# Altium schematic sheet Latching - AMS.SchDoc
size A3
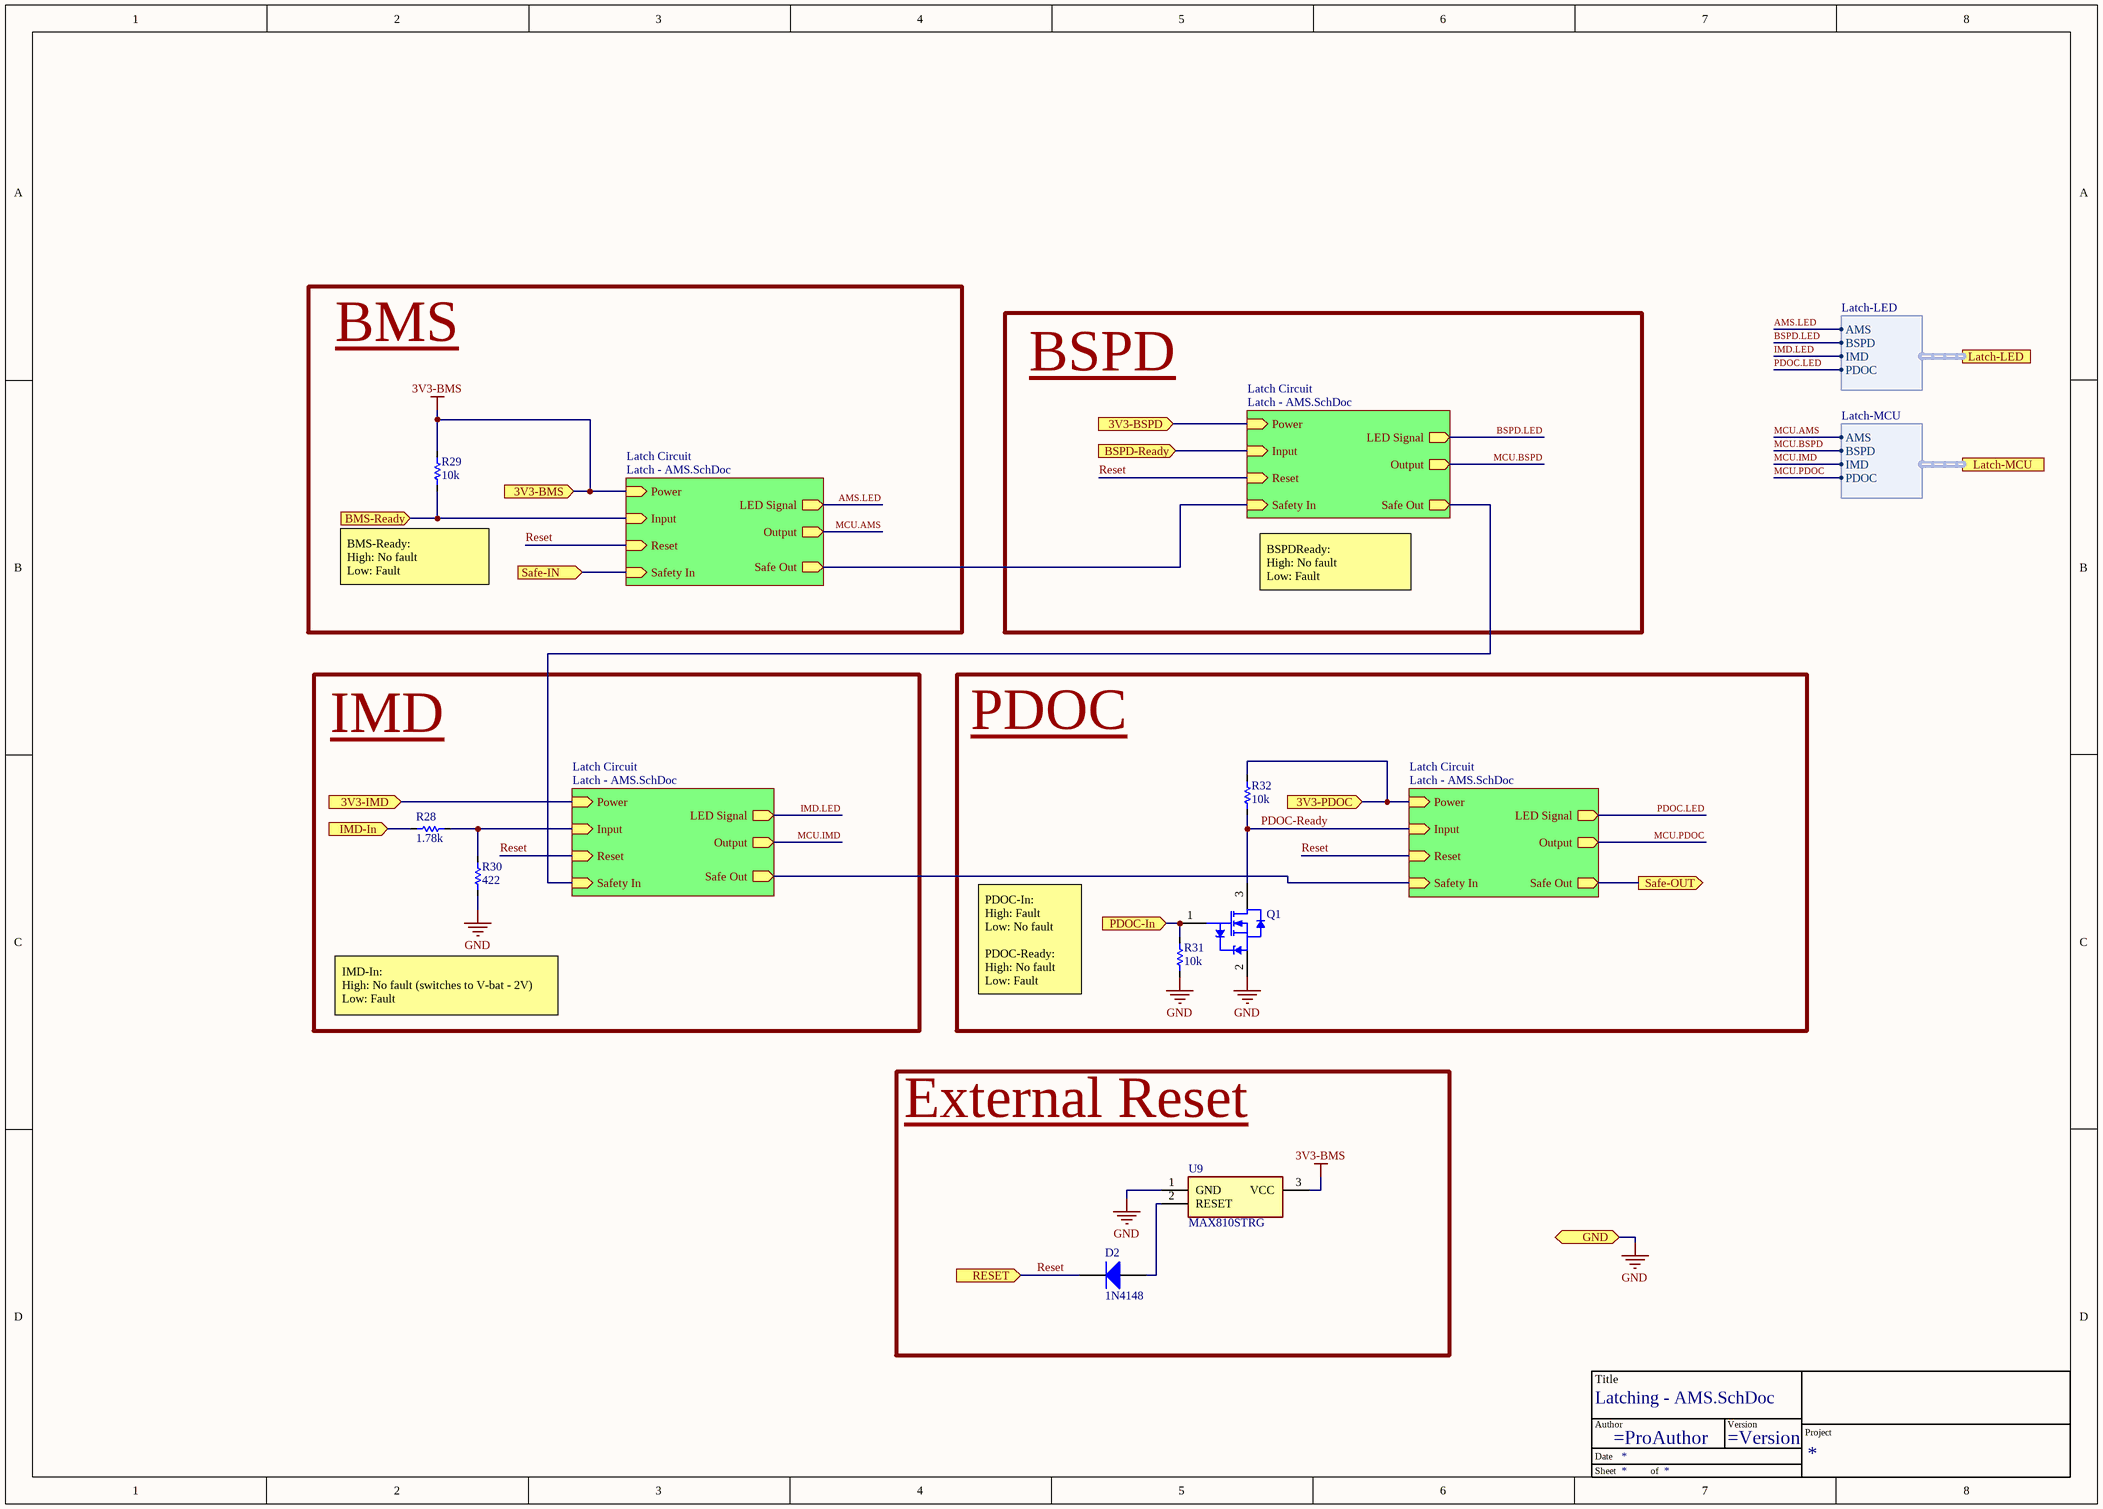
[diagram p0: Latching - AMS.SchDoc]

## Parts
*  TitleBlock  (value not drawn)  (graphical)
D2  1N4148  [425]
Q1  BSS138BK,215  [NXP-SOT23_N]  (value not drawn)
R28  value 1.78k  [R-0603]  (hidden comment: RC0603FR-071K78L)
R29  value 10k  [R-0603]  (hidden comment: RC0603FR-1310KL)
R30  value 422  [R-0603]  (hidden comment: CR0603-FX-4220ELF)
R31  value 10k  [R-0603]  (hidden comment: RC0603FR-1310KL)
R32  value 10k  [R-0603]  (hidden comment: RC0603FR-1310KL)
U9  MAX810STRG  [SOT96P237X111-3N]

## Blocks framed on the sheet
BMS: R29
IMD: R28 R30
PDOC: Q1 R31 R32
External Reset: D2 U9

## Sub-sheets
Latch Circuit = Latch - AMS.SchDoc: Input (in), Safety In (in), Safe Out (out), LED Signal (out), Power (in), Output (out), Reset (in)
Latch Circuit = Latch - AMS.SchDoc: Input (in), Safety In (in), Safe Out (out), LED Signal (out), Power (in), Output (out), Reset (in)
Latch Circuit = Latch - AMS.SchDoc: Input (in), Safety In (in), Safe Out (out), LED Signal (out), Power (in), Output (out), Reset (in)
Latch Circuit = Latch - AMS.SchDoc: Input (in), Safety In (in), Safe Out (out), LED Signal (out), Power (in), Output (out), Reset (in)

## Ports
3V3-BMS (in), 3V3-BSPD (in), 3V3-IMD (in), 3V3-PDOC (in), BMS-Ready (in), BSPD-Ready (in), GND (bidir), IMD-In (in), Latch-LED (harness Latch-LED), Latch-MCU (harness Latch-MCU), PDOC-In (in), RESET (in), Safe-IN (in), Safe-OUT (out)

## Harnesses
Latch-LED: AMS, BSPD, IMD, PDOC
Latch-MCU: AMS, BSPD, IMD, PDOC

## Nets
3V3-BMS: R29.2 U9.3(VCC) ; port 3V3-BMS, sheet Latch Circuit/Power
GND: Q1.2(S) R30.1 R31.1 U9.1(GND) ; port GND
3V3-BSPD: port 3V3-BSPD, sheet Latch Circuit/Power
3V3-IMD: port 3V3-IMD, sheet Latch Circuit/Power
3V3-PDOC: R32.2 ; port 3V3-PDOC, sheet Latch Circuit/Power
AMS.LED: sheet Latch Circuit/LED Signal, port Latch-LED.AMS
BMS-Ready: R29.1 ; port BMS-Ready, sheet Latch Circuit/Input
BSPD-Ready: port BSPD-Ready, sheet Latch Circuit/Input
BSPD.LED: sheet Latch Circuit/LED Signal, port Latch-LED.BSPD
IMD-In: R28.2 ; port IMD-In
IMD.LED: sheet Latch Circuit/LED Signal, port Latch-LED.IMD
MCU.AMS: sheet Latch Circuit/Output, port Latch-MCU.AMS
MCU.BSPD: sheet Latch Circuit/Output, port Latch-MCU.BSPD
MCU.IMD: sheet Latch Circuit/Output, port Latch-MCU.IMD
MCU.PDOC: sheet Latch Circuit/Output, port Latch-MCU.PDOC
PDOC-In: Q1.1(G) R31.2 ; port PDOC-In
PDOC-Ready: Q1.3(D) R32.1 ; sheet Latch Circuit/Input
PDOC.LED: sheet Latch Circuit/LED Signal, port Latch-LED.PDOC
Reset: D2.2(K) ; port RESET, sheet Latch Circuit/Reset, sheet Latch Circuit/Reset, sheet Latch Circuit/Reset, sheet Latch Circuit/Reset
Safe-IN: port Safe-IN, sheet Latch Circuit/Safety In
Safe-OUT: port Safe-OUT, sheet Latch Circuit/Safe Out
NetD2_1: D2.1(A) U9.2(RESET)
NetR28_1: R28.1 R30.2 ; sheet Latch Circuit/Input
(unnamed): sheet Latch Circuit/Safety In, sheet Latch Circuit/Safe Out
(unnamed): sheet Latch Circuit/Safe Out, sheet Latch Circuit/Safety In
(unnamed): sheet Latch Circuit/Safe Out, sheet Latch Circuit/Safety In

## Notes on the sheet
- BSPD
- (near R29) BMS-Ready:
  High: No fault
  Low: Fault
- BSPDReady:
  High: No fault
  Low: Fault
- PDOC-In:
  High: Fault
  Low: No fault
  PDOC-Ready:
  High: No fault
  Low: Fault
- IMD-In:
  High: No fault (switches to V-bat - 2V)
  Low: Fault
- (in symbol TitleBlock) Title; Author; Version; Project; Date; Sheet; of

## Library data of the parts
D2 = 1N4148W-7-F: DIODE GEN PURP 100V 300MA SOD123; Manufacturer 1: Diodes; Forward Current: 150mA; Element Configuration: Single; Reverse Recovery Time: 4ns; Max Forward Surge Current (Ifsm): 2A; Polarity: Standard; Voltage Rating (DC): 75V; Power Rating: 400mW; Capacitance: 2pF; Peak Reverse Current: 1uA; Forward Voltage: 1.25V; Supplier 1: Digi-Key; Supplier Part Number 1: 1N4148W-FDIDKR-ND; Manufacturer Part Number 1: 1N4148W-7-F; Stock 1: 3523690; Pricing 1: 1=0.16000, 10=0.14600, 25=0.13880, 100=0.06110, 250=0.05868, 500=0.04800, 1000=0.03333 (USD); RoHS: Yes; Mount: Surface Mount; Number of Pins: 2; Weight: 0.000353oz; Contact Plating: Tin,Matte; Min Operating Temperature: -65°C; Max Operating Temperature: 150°C; Voltage: 100V; Packaging: Tape and Reel; Max Repetitive Reverse Voltage (Vrrm): 100V; Peak Non-Repetitive Surge Current: 2A; Current Rating: 150mA; Output Current: 150mA; Max Surge Current: 2A; Package Quantity: 3000; Recovery Time: 4ns; Max Reverse Voltage (DC): 100V; Average Rectified Current: 300mA; Power Dissipation: 400mW; Length: 2.85mm; Height: 1.25mm; Width: 1.7mm; Radiation Hardening: No; REACH SVHC: No SVHC; Lead Free: Lead Free; ComponentLink1URL: https://datasheet.ciiva.com/911/ds30086-911734.pdf?src-supplier=Digi-Key; ComponentLink1Description: https://datasheet.ciiva.com/911/ds30086-911734.pdf?src-supplier=Digi-Key; ComponentLink2URL: https://datasheet.ciiva.com/911/ds30086-911735.pdf?src-supplier=Digi-Key; ComponentLink2Description: https://datasheet.ciiva.com/911/ds30086-911735.pdf?src-supplier=Digi-Key; ComponentLink3URL: https://datasheet.ciiva.com/911/ds30086-911736.pdf?src-supplier=Digi-Key; ComponentLink3Description: https://datasheet.ciiva.com/911/ds30086-911736.pdf?src-supplier=Digi-Key; ComponentLink4URL: https://datasheet.ciiva.com/8300/ds30086-8300392.pdf?src-supplier=Avnet; ComponentLink4Description: https://datasheet.ciiva.com/8300/ds30086-8300392.pdf?src-supplier=Avnet; ComponentLink5URL: https://datasheet.ciiva.com/25919/ds30086-25919609.pdf?src-supplier=Avnet+Europe; ComponentLink5Description: https://datasheet.ciiva.com/25919/ds30086-25919609.pdf?src-supplier=Avnet+Europe; ComponentLink6URL: https://datasheet.ciiva.com/22695/1915529-22695239.pdf?src-supplier=Element14; ComponentLink6Description: https://datasheet.ciiva.com/22695/1915529-22695239.pdf?src-supplier=Element14; ComponentLink7URL: https://datasheet.ciiva.com/1179/1915529-1179304.pdf?src-supplier=Element14; ComponentLink7Description: https://datasheet.ciiva.com/1179/1915529-1179304.pdf?src-supplier=Element14; ComponentLink8URL: https://datasheet.ciiva.com/4435/ds30086-4435128.pdf?src-supplier=Mouser; ComponentLink8Description: https://datasheet.ciiva.com/4435/ds30086-4435128.pdf?src-supplier=Mouser; ComponentLink9URL: https://datasheet.ciiva.com/15219/getdatasheetpartid-110030-15219548.pdf?src-supplier=Verical; ComponentLink9Description: https://datasheet.ciiva.com/15219/getdatasheetpartid-110030-15219548.pdf?src-supplier=Verical; ComponentLink10URL: https://datasheet.ciiva.com/8303/ds30086-8303197.pdf?src-supplier=Avnet; ComponentLink10Description: https://datasheet.ciiva.com/8303/ds30086-8303197.pdf?src-supplier=Avnet
Q1 = CMP-1259-00087-1: N-Channel Trench MOSFET, 60 V, 0.36 A, -55 to 150 degC, 3-Pin SOT23, Tape and Reel; Manufacturer: NXP Semiconductors; Channel Type: N; IDM [max] (A): 1.2; VDS [max] (V): 60; Packing: Tape & Reel; ID [max] (A): 0.36; Automotive Qualified: Y; VGSth [typ] (V): 1.1; PackageReference: SOT23; Code_JEDEC: TO-236AB; PackageDescription: 3-Pin Small Outline Transistor Package, Body 2.9 x 1.3 mm, Pitch 0.95 mm; ComponentLink2URL: http://www.nxp.com/documents/data_sheet/BSS138BK.pdf; PartNumber: BSS138BK,215; DatasheetVersion: Rev. 1; ComponentLink3Description: Package Specification; ComponentLink3URL: http://www.nxp.com/documents/outline_drawing/sot023_po.pdf; Mounting Technology: Surface Mount; ComponentLink1URL: http://www.nxp.com/; ComponentLink1Description: Manufacturer URL; ComponentLink2Description: Datasheet; PackageVersion: 06-03-16, 03/2006
R28-R32 = Resistor
U9 = MAX810TTRG: Integrated Circuit; Manufacturer_Name: ON Semiconductor; Datasheet Link: http://www.onsemi.com/pub/Collateral/MAX809S-D.PDF; Height: 1.11mm; Manufacturer_Part_Number: MAX810TTRG